# EAGLE design Krzysztof.Molski (EAGLE 9.6.1)
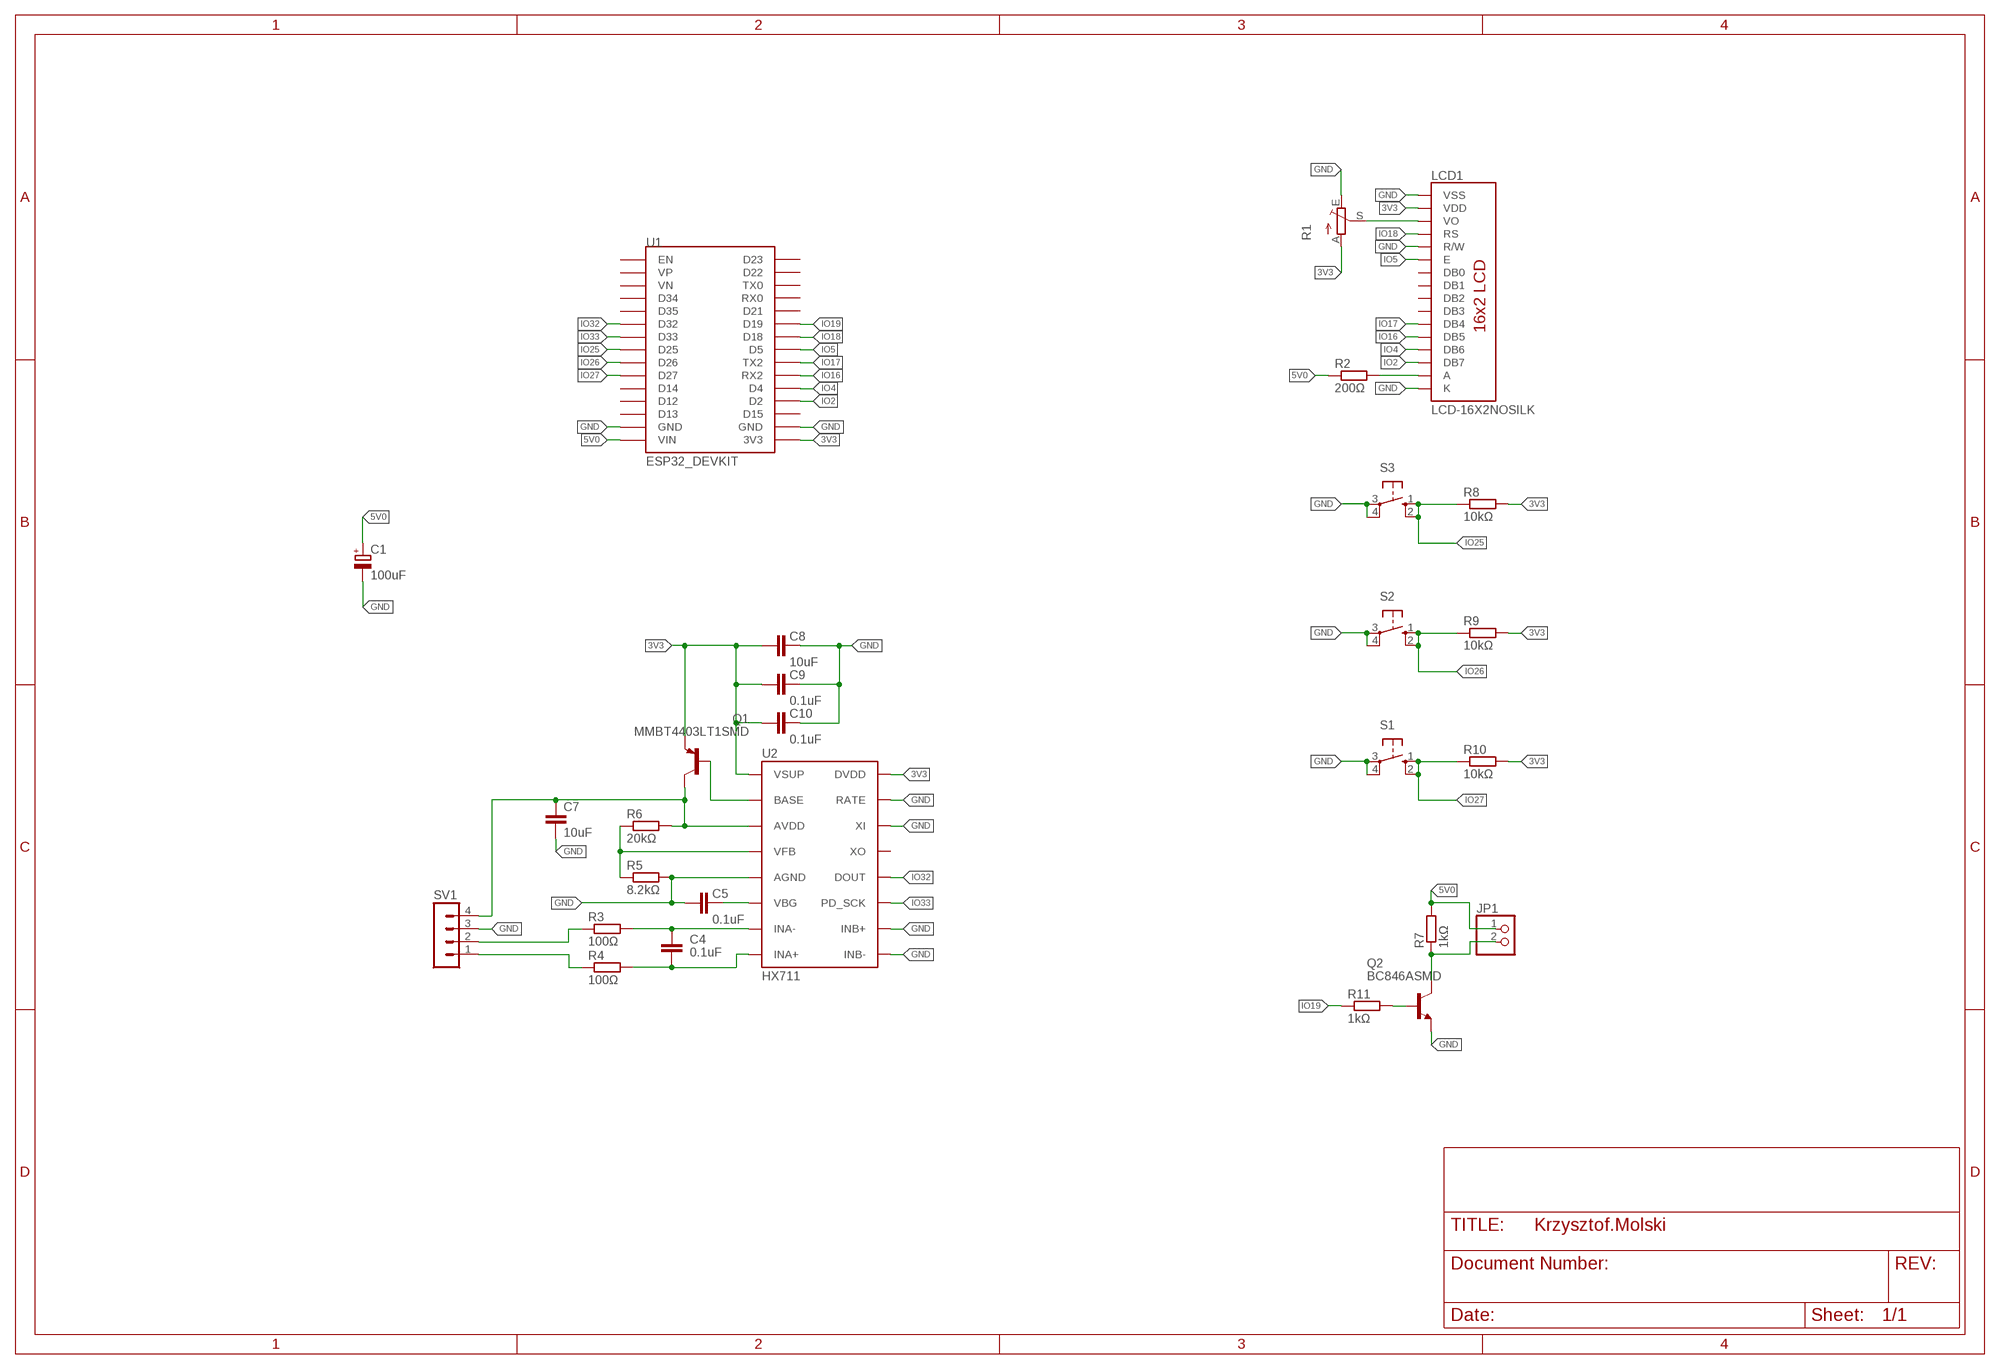
[diagram p0: schematic, sheet 1]

## Parts
C1  100uF  CPOL-EUCT3528  [CT3528]
C4  0.1uF  C-EUC1206  [C1206]
C5  0.1uF  C-EUC1206  [C1206]
C7  10uF  C-EUC1206  [C1206]
C8  10uF  C-EUC1206  [C1206]
C9  0.1uF  C-EUC1206  [C1206]
C10  0.1uF  C-EUC1206  [C1206]
JP1  PINHD-1X2  [1X02]
LCD1  LCD-16X2NOSILK  [LCD-16X2_NOSILK]
Q1  MMBT4403LT1SMD  [SOT23-BEC]
Q2  BC846ASMD  [SOT23]
R1  TRIM_EU-CA6V  [CA6V]
R2  200Ω  R-EU_R0805  [R0805]
R3  100Ω  R-EU_R0805  [R0805]
R4  100Ω  R-EU_R0805  [R0805]
R5  8.2kΩ  R-EU_R0805  [R0805]
R6  20kΩ  R-EU_R0805  [R0805]
R7  1kΩ  R-EU_R0805  [R0805]
R8  10kΩ  R-EU_R0805  [R0805]
R9  10kΩ  R-EU_R0805  [R0805]
R10  10kΩ  R-EU_R0805  [R0805]
R11  1kΩ  R-EU_R0805  [R0805]
S1  10-XX  [B3F-10XX]
S2  10-XX  [B3F-10XX]
S3  10-XX  [B3F-10XX]
SV1  MA04-1  [MA04-1]
U1  ESP32_DEVKIT  [ESP32_DEVKIT]
U2  HX711  [SO16]

## Nets
3V3 [Power]: C8.2 C9.2 C10.2 LCD1.2(VDD) Q1.E R1.A R8.2 R9.2 R10.2 U1.3V3 U2.1(VSUP) U2.16(DVDD)
5V0 [Power]: C1.+ JP1.1 R2.1 R7.2 U1.VIN
GND [Power]: C1.- C5.2 C7.2 C8.1 C9.1 C10.1 LCD1.1(VSS) LCD1.5(R/W) LCD1.16(K) Q2.2(E) R1.E R5.2 S1.3(P) S1.4(P1) S2.3(P) S2.4(P1) S3.3(P) S3.4(P1) SV1.3 U1.GND@1(GND) U1.GND@2(GND) U2.5(AGND) U2.9(INB-) U2.10(INB+) U2.14(XI) U2.15(RATE)
IO2: LCD1.14(DB7) U1.D2
IO4: LCD1.13(DB6) U1.D4
IO5: LCD1.6(E) U1.D5
IO16: LCD1.12(DB5) U1.RX2
IO17: LCD1.11(DB4) U1.TX2
IO18: LCD1.4(RS) U1.D18
IO19: R11.1 U1.D19
IO25: R8.1 S3.1(S) S3.2(S1) U1.D25
IO26: R9.1 S2.1(S) S2.2(S1) U1.D26
IO27: R10.1 S1.1(S) S1.2(S1) U1.D27
IO32: U1.D32 U2.12(DOUT)
IO33: U1.D33 U2.11(PD_SCK)
N$1: C4.1 R4.2 U2.8(INA+)
N$2: R3.1 SV1.2
N$3: LCD1.15(A) R2.2
N$4: C4.2 R3.2 U2.7(INA-)
N$5: Q1.B U2.2(BASE)
N$6: LCD1.3(VO) R1.S
N$8: Q2.1(B) R11.2
N$9: R4.1 SV1.1
N$10: C5.1 U2.6(VBG)
N$11: C7.1 Q1.C R6.2 SV1.4 U2.3(AVDD)
N$12: R5.1 R6.1 U2.4(VFB)
N$13: JP1.2 Q2.3(C) R7.1
Unconnected: LCD1.7(DB0) LCD1.8(DB1) LCD1.9(DB2) LCD1.10(DB3) U1.D12 U1.D13 U1.D14 U1.D15 U1.D21 U1.D22 U1.D23 U1.D34 U1.D35 U1.EN U1.RX0 U1.TX0 U1.VN U1.VP U2.13(XO)

## Library data of the parts
C1 = Krzysztof.Molski:CPOL-EU: POLARIZED CAPACITOR, European symbol; SPICEPREFIX: C
C4 C5 C7-C10 = Krzysztof.Molski:C-EU: CAPACITOR, European symbol; SPICEPREFIX: C
JP1 = Krzysztof.Molski:PINHD-1X2: PIN HEADER
LCD1 = Krzysztof.Molski:LCD-16X2: Standard text-only 16x2 parallel input LCD Basic 16 character by 2 line display. Typically utilizes the extremely common HD44780 parallel interface chipset SparkFun Products: Basic 16x2 Green <https://www.sparkfun.com/products/255> Basic 8x2 Green <https://www.sparkfun.com/products/11122>; PROD_ID: LCD-12633; SF_ID: LCD-00255
Q1 = Krzysztof.Molski:MMBT4403*: PNP Transistror
Q2 = Krzysztof.Molski:BC846*: NPN Transistor
R1 = Krzysztof.Molski:TRIM_EU-: POTENTIOMETER
R2-R11 = Krzysztof.Molski:R-EU_: RESISTOR, European symbol; SPICEPREFIX: R
S1-S3 = Krzysztof.Molski:10-XX: OMRON SWITCH; MPN: B3F-1000; OC_FARNELL: 176432; OC_NEWARK: 36M3542
SV1 = Krzysztof.Molski:MA04-1: PIN HEADER; OC_FARNELL: unknown; OC_NEWARK: unknown
U1 = Krzysztof.Molski:ESP32_DEVKIT: ESP32 DEVKIT BOARD
U2 = Krzysztof.Molski:HX711: AVIA Semiconductor HX711 - ADC 24-Bit Analog-to-Digital Converter for Weigh Scales Datasheet <https://cdn.sparkfun.com/datasheets/Sensors/ForceFlex/hx711_english.pdf> SparkFun Products: SparkFun Load Cell Amplifier - HX711 <https://www.sparkfun.com/products/13879>; PROD_ID: IC-12445

## Net classes
1 Power: width 1.27 mm, clearance 0.33 mm

## Board
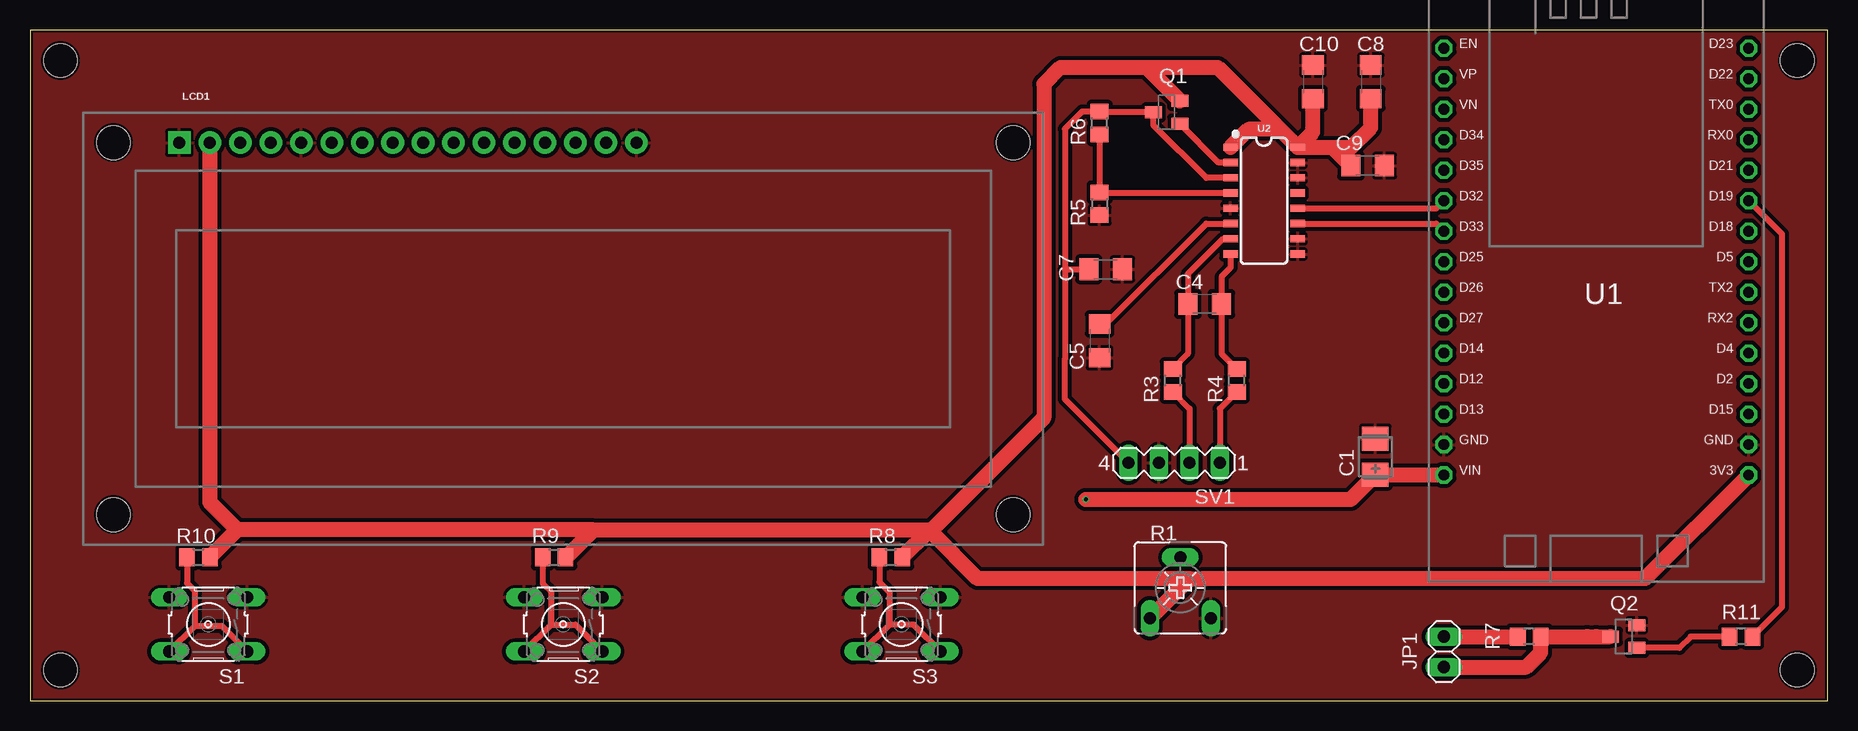
[diagram p1: board, top side]
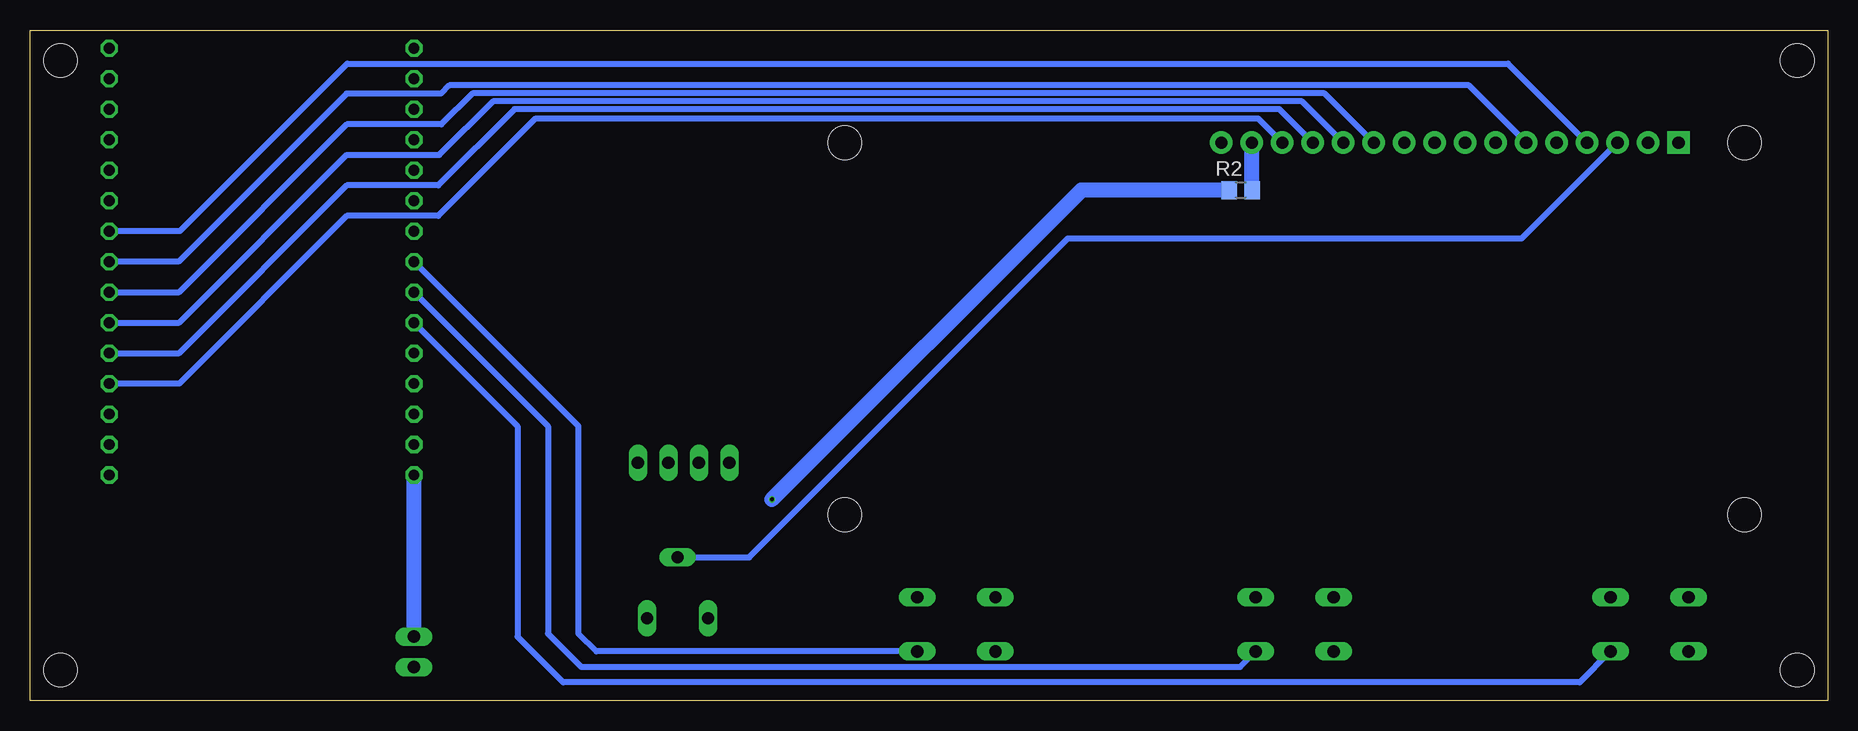
[diagram p2: board, bottom side, seen from below]

Size 149.86 x 55.88 mm. Coordinates in mm from the lower left corner, seen from the top.
Outline: 0,0 149.86,0 149.86,55.88 0,55.88 0,0
Copper layers (1*16): Top 0.035559375mm / dielectric 1.6mm / Bottom 0.035559375mm
Design rules "jlcpcb2layer *": minimum track width 6mil, minimum drill 12mil, track to track 6mil, track to pad 6mil, pad to pad 6mil, via to via 6mil, smd to smd 6mil, copper to edge 8mil, drill to drill 6mil, minimum pad ring 5mil, minimum via ring 3mil, stop-mask expansion 2.5mil, vias tented up to drill 0mil, thermal gap 10mil
Holes 2.8 mm at 2.54,53.34 2.54,2.54 147.32,2.54 147.32,53.34

### Footprints (pad centres in the part's own frame; a part is rotated, then mirrored left to right if it is on the bottom)
CT3528 = smd 2 x 2.2: + -1.5,0; - 1.5,0
C1206 = smd 1.6 x 1.8: 1 -1.4,0; 2 1.4,0
1X02 = drill 1.016 long: 1 -1.27,0; 2 1.27,0
LCD-16X2_NOSILK = drill 1.016 pad 1.88 square: 1 -32,15.5 | drill 1.016 pad 1.88: 2 -29.46,15.5; 3 -26.92,15.5; 4 -24.38,15.5; 5 -21.84,15.5; 6 -19.3,15.5; 7 -16.76,15.5; 8 -14.22,15.5; 9 -11.68,15.5; 10 -9.14,15.5; 11 -6.6,15.5; 12 -4.06,15.5; 13 -1.52,15.5; 14 1.02,15.5; 15 3.56,15.5; 16 6.1,15.5 | hole 2.8: -37.5,15.5; -37.5,-15.5; 37.5,15.5; 37.5,-15.5
SOT23-BEC = smd 1 x 1.4: B -0.95,-1.1; C 0,1.1; E 0.95,-1.1
SOT23 = smd 1 x 1.4: 1 -0.95,-1.1; 2 0.95,-1.1; 3 0,1.1
CA6V = drill 1.016 long: A -2.54,-2.54; E 2.54,-2.54; S 0,2.54
R0805 = smd 1.3 x 1.5: 1 -0.95,0; 2 0.95,0
B3F-10XX = drill 1.016 long: 1 -3.251,2.261; 2 3.251,2.261; 3 -3.251,-2.261; 4 3.251,-2.261
MA04-1 = drill 1.016 long: 1 -3.81,0; 2 -1.27,0; 3 1.27,0; 4 3.81,0
ESP32_DEVKIT = drill 0.9 pad 1.422 octagon: 3V3 11.43,-17.78; D2 11.43,-10.16; D4 11.43,-7.62; D5 11.43,0; D12 -13.97,-10.16; D13 -13.97,-12.7; D14 -13.97,-7.62; D15 11.43,-12.7; D18 11.43,2.54; D19 11.43,5.08; D21 11.43,7.62; D22 11.43,15.24; D23 11.43,17.78; D25 -13.97,0; D26 -13.97,-2.54; D27 -13.97,-5.08; D32 -13.97,5.08; D33 -13.97,2.54; D34 -13.97,10.16; D35 -13.97,7.62; EN -13.97,17.78; GND@1 -13.97,-15.24; GND@2 11.43,-15.24; RX0 11.43,10.16; RX2 11.43,-5.08; TX0 11.43,12.7; TX2 11.43,-2.54; VIN -13.97,-17.78; VN -13.97,12.7; VP -13.97,15.24
SO16 = smd 0.6 x 1.2: 1 -4.445,-2.8; 2 -3.175,-2.8; 3 -1.905,-2.8; 4 -0.635,-2.8; 5 0.635,-2.8; 6 1.905,-2.8; 7 3.175,-2.8; 8 4.445,-2.8; 9 4.445,2.8; 10 3.175,2.8; 11 1.905,2.8; 12 0.635,2.8; 13 -0.635,2.8; 14 -1.905,2.8; 15 -3.175,2.8; 16 -4.445,2.8

### Placement (x,y rotation side)
C1  112.14,20.32 90 top
C4  97.92,33.05 180 top
C5  89.15,29.97 270 top
C7  89.66,35.94 0 top
C8  111.76,51.56 270 top
C9  111.51,44.58 180 top
C10  106.93,51.56 270 top
JP1  117.86,4.06 270 top
LCD1  44.45,30.99 0 top
Q1  94.74,49.02 90 top
Q2  132.84,5.33 90 top
R1  95.89,9.4 0 top
R2  48.95,42.55 0 bottom
R3  95.25,26.67 90 top
R4  100.58,26.67 90 top
R5  89.15,41.4 270 top
R6  89.15,48.13 90 top
R7  124.97,5.33 180 top
R8  71.75,11.94 0 top
R9  43.69,11.94 0 top
R10  14.05,11.94 0 top
R11  142.62,5.33 180 top
S1  14.86,6.35 180 top
S2  44.45,6.35 180 top
S3  72.64,6.35 180 top
SV1  95.38,19.81 180 top
U1  131.83,36.58 0 top
U2  102.87,41.66 270 top

### Tracks (layer width: path | path; a pad name or v marks a point on that pad's centre or on a via)
3V3
  Top 1.27: 75.06,14.1 84.52,23.56 84.52,51.37 85.92,52.77 93.05,52.77 | LCD1.2 14.99,16.51 15,16.51 17.28,14.22 | U2.1 101.57,47.6 104.17,47.6 | 46.99,14.22 44.7,11.94 R9.2 | 93.05,52.77 99,52.77 104.17,47.6 | U2.16 104.17,47.6 | U2.16 106.93,47.37 C10.2 | U2.16 108.58,46.1 | C9.2 108.58,46.1 | 108.58,46.1 110.11,46.1 111.76,47.75 C8.2 | 46.99,14.22 74.93,14.22 | Q1.E 93.05,52.77 | 74.93,14.22 75.06,14.1 | 75.06,14.1 78.99,10.16 96.65,10.16 | U1.3V3 134.62,10.16 97.79,10.16 96.65,10.16 | R8.2 74.93,14.16 74.93,14.22 | 46.99,14.22 17.28,14.22 | R10.2 17.28,14.22 | R1.A 96.65,10.16
5V0  (via drill 0.35)
  Top 1.27: v88.01,16.76 110.08,16.76 C1.+ 117.83,18.82 U1.VIN | JP1.1 R7.2
  Bottom 1.27: v88.01,16.76 62.23,42.55 R2.1 | JP1.1 U1.VIN
GND
  pour Top (rank 2): 0,55.88 0,0 149.86,0 149.86,55.88
IO2
  Bottom 0.508: U1.D2 137.41,26.42 123.44,40.39 115.82,40.39 107.7,48.51 47.5,48.51 LCD1.14
IO4
  Bottom 0.508: U1.D4 137.41,28.96 123.44,42.93 115.82,42.93 109.47,49.28 45.72,49.28 LCD1.13
IO5
  Bottom 0.508: U1.D5 137.48,36.58 123.48,50.58 115.6,50.58 114.92,51.26 29.92,51.26 LCD1.6
IO16
  Bottom 0.508: U1.RX2 137.41,31.5 123.44,45.47 115.73,45.47 111.27,49.94 43.84,49.94 LCD1.12
IO17
  Bottom 0.508: U1.TX2 137.41,34.04 123.44,48.01 115.57,48.01 112.98,50.6 41.96,50.6 LCD1.11
IO18
  Bottom 0.508: U1.D18 137.38,39.12 123.41,53.09 26.67,53.09 LCD1.4
IO19
  Top 0.508: R11.1 146.05,7.81 146.05,38.86 U1.D19
IO25
  Top 0.508: S3.1 73.66,6.33 71.63,6.33 | 71.63,6.33 S3.2 | 71.63,6.33 71.63,9.04 70.81,9.86 R8.1
  Bottom 0.508: U1.D25 104.14,22.86 104.14,5.59 102.64,4.09 S3.1
IO26
  Top 0.508: 43.43,6.33 45.47,6.33 S2.1 | S2.2 43.43,6.33 | 43.43,6.33 43.43,9.06 42.74,9.75 R9.1
  Bottom 0.508: U1.D26 106.68,22.86 106.68,5.58 103.9,2.79 49,2.79 S2.1
IO27
  Top 0.508: R10.1 13.1,9.79 13.72,9.17 13.72,6.2 | 13.72,6.2 S1.2 | S1.1 16,6.2 13.72,6.2
  Bottom 0.508: U1.D27 109.22,22.86 109.22,5.33 105.41,1.52 20.68,1.52 S1.1
IO32
  Top 0.508: U2.12 117.22,41.02 U1.D32
IO33
  Top 0.508: U1.D33 117.22,39.75 U2.11
N$1
  Top 0.508: U2.8 100.07,36.07 99.32,35.31 C4.1 99.32,28.89 R4.2
N$2
  Top 0.508: R3.1 96.65,24.32 SV1.2
N$3
  Bottom 1.27: R2.2 48,46.47 LCD1.15
N$4
  Top 0.508: U2.7 99.44,38.48 96.52,35.56 C4.2 96.52,28.89 R3.2
N$5
  Top 0.508: U2.2 99.08,44.83 Q1.B
N$6
  Bottom 0.508: R1.S 89.92,11.94 63.35,38.51 25.51,38.51 LCD1.3
N$8
  Top 0.508: R11.2 138.43,5.33 137.48,4.38 Q2.1
N$9
  Top 0.508: R4.1 99.19,24.32 SV1.1
N$10
  Top 0.508: U2.6 98.04,39.75 89.67,31.37 C5.1
N$11
  Top 0.508: U2.3 98.04,43.56 93.64,47.96 Q1.C 89.22,49.02 R6.2 87.69,49.08 86.26,47.65 86.26,35.94 | 86.26,35.94 86.26,28.45 86.26,25.12 SV1.4 | 86.26,35.94 C7.1
N$12
  Top 0.508: R6.1 R5.1 89.22,42.29 U2.4
N$13
  Top 1.27: Q2.3 130.56,5.33 129.79,5.33 R7.1 125.92,4 124.71,2.79 JP1.2